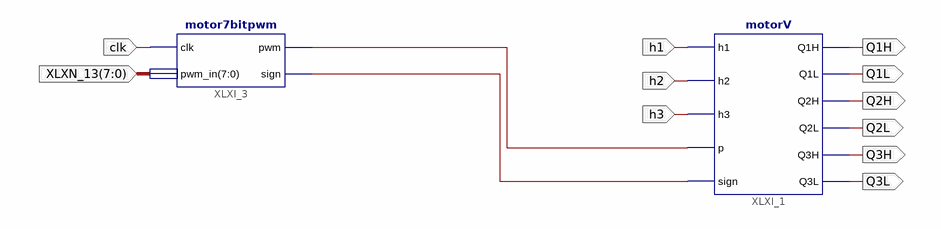
[diagram p0: schematic sheet 1]
// Xilinx ISE schematic control.sch (spartan6) as structural Verilog: 2 symbols, 11 ports
module control (
  input  clk,
  input  h1,
  input  h2,
  input  h3,
  input  [7:0] XLXN_13,
  output Q1H,
  output Q1L,
  output Q2H,
  output Q2L,
  output Q3H,
  output Q3L
);

  wire XLXN_2, XLXN_3;

  motorV XLXI_1 (
    .h1(h1), .h2(h2), .h3(h3), .p(XLXN_3), .sign(XLXN_2), .Q1H(Q1H), .Q1L(Q1L), .Q2H(Q2H), .Q2L(Q2L),
    .Q3H(Q3H), .Q3L(Q3L));
  motor7bitpwm XLXI_3 (.clk(clk), .pwm_in(XLXN_13), .pwm(XLXN_3), .sign(XLXN_2));
endmodule
